# EasyEDA Pro project ProProject_扫描隧道显微镜OpenSTM_2023-08-25.epro, board ControlBoard
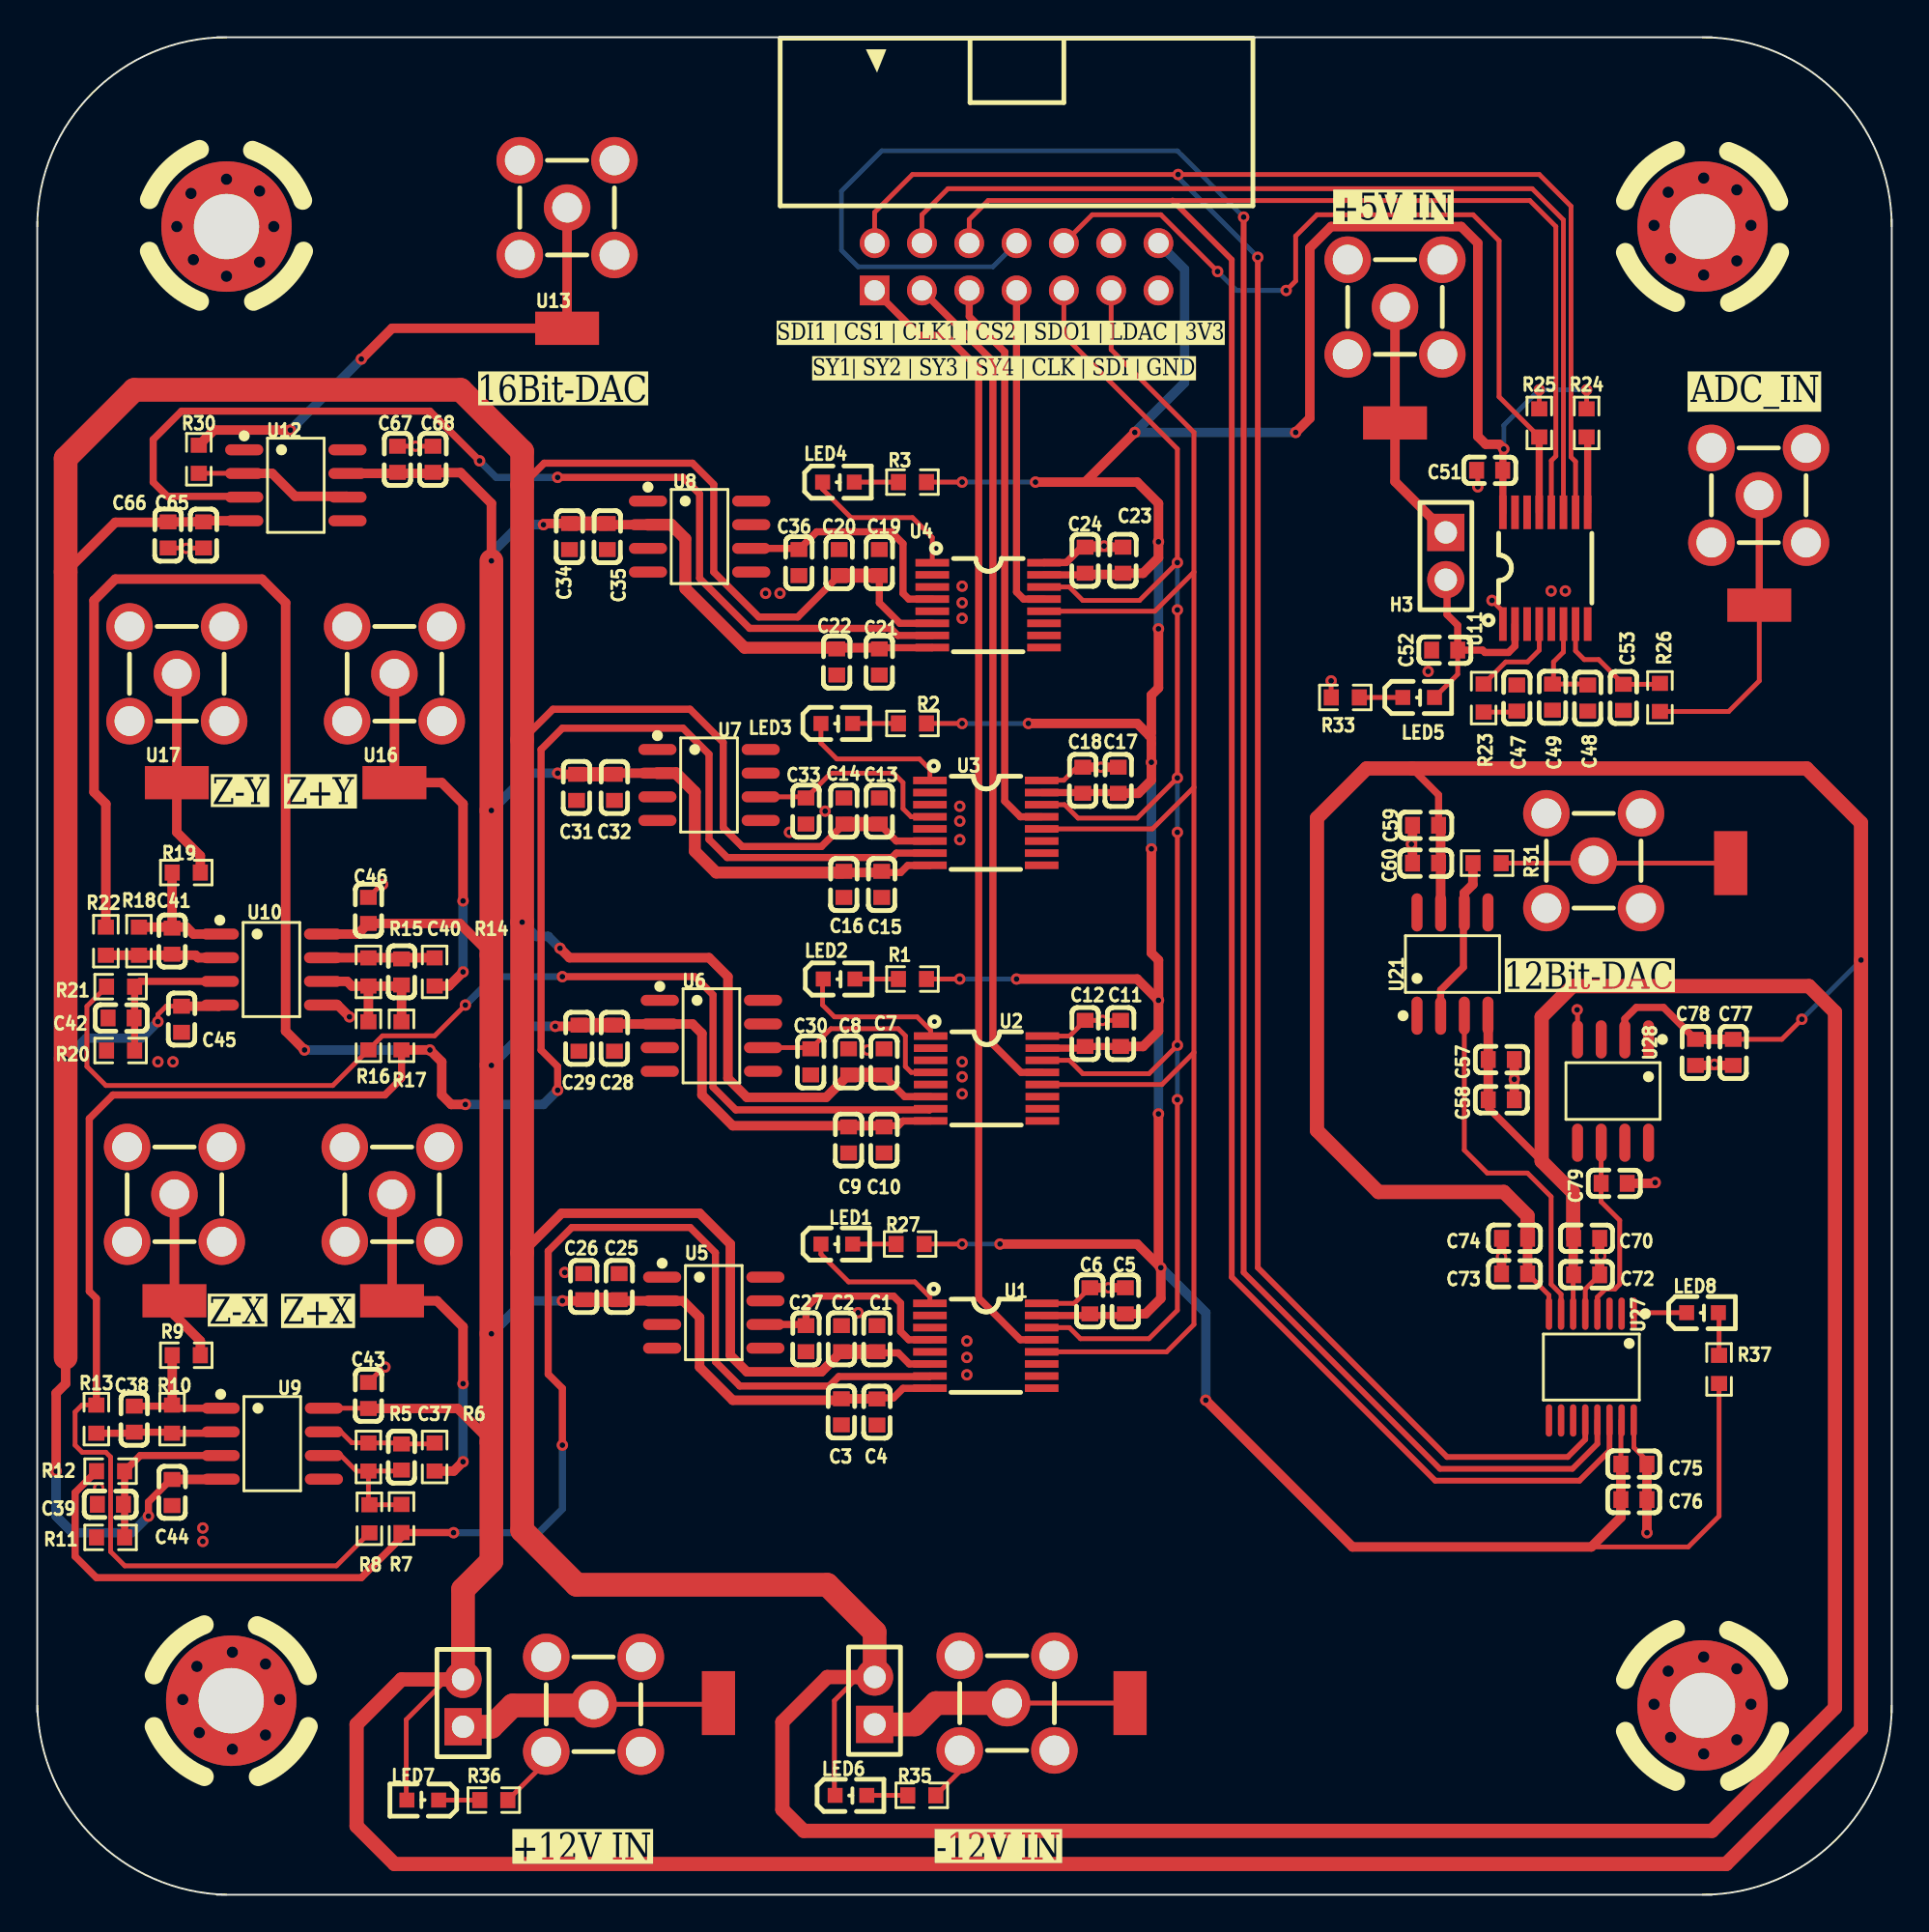
[diagram p14: board, top side]
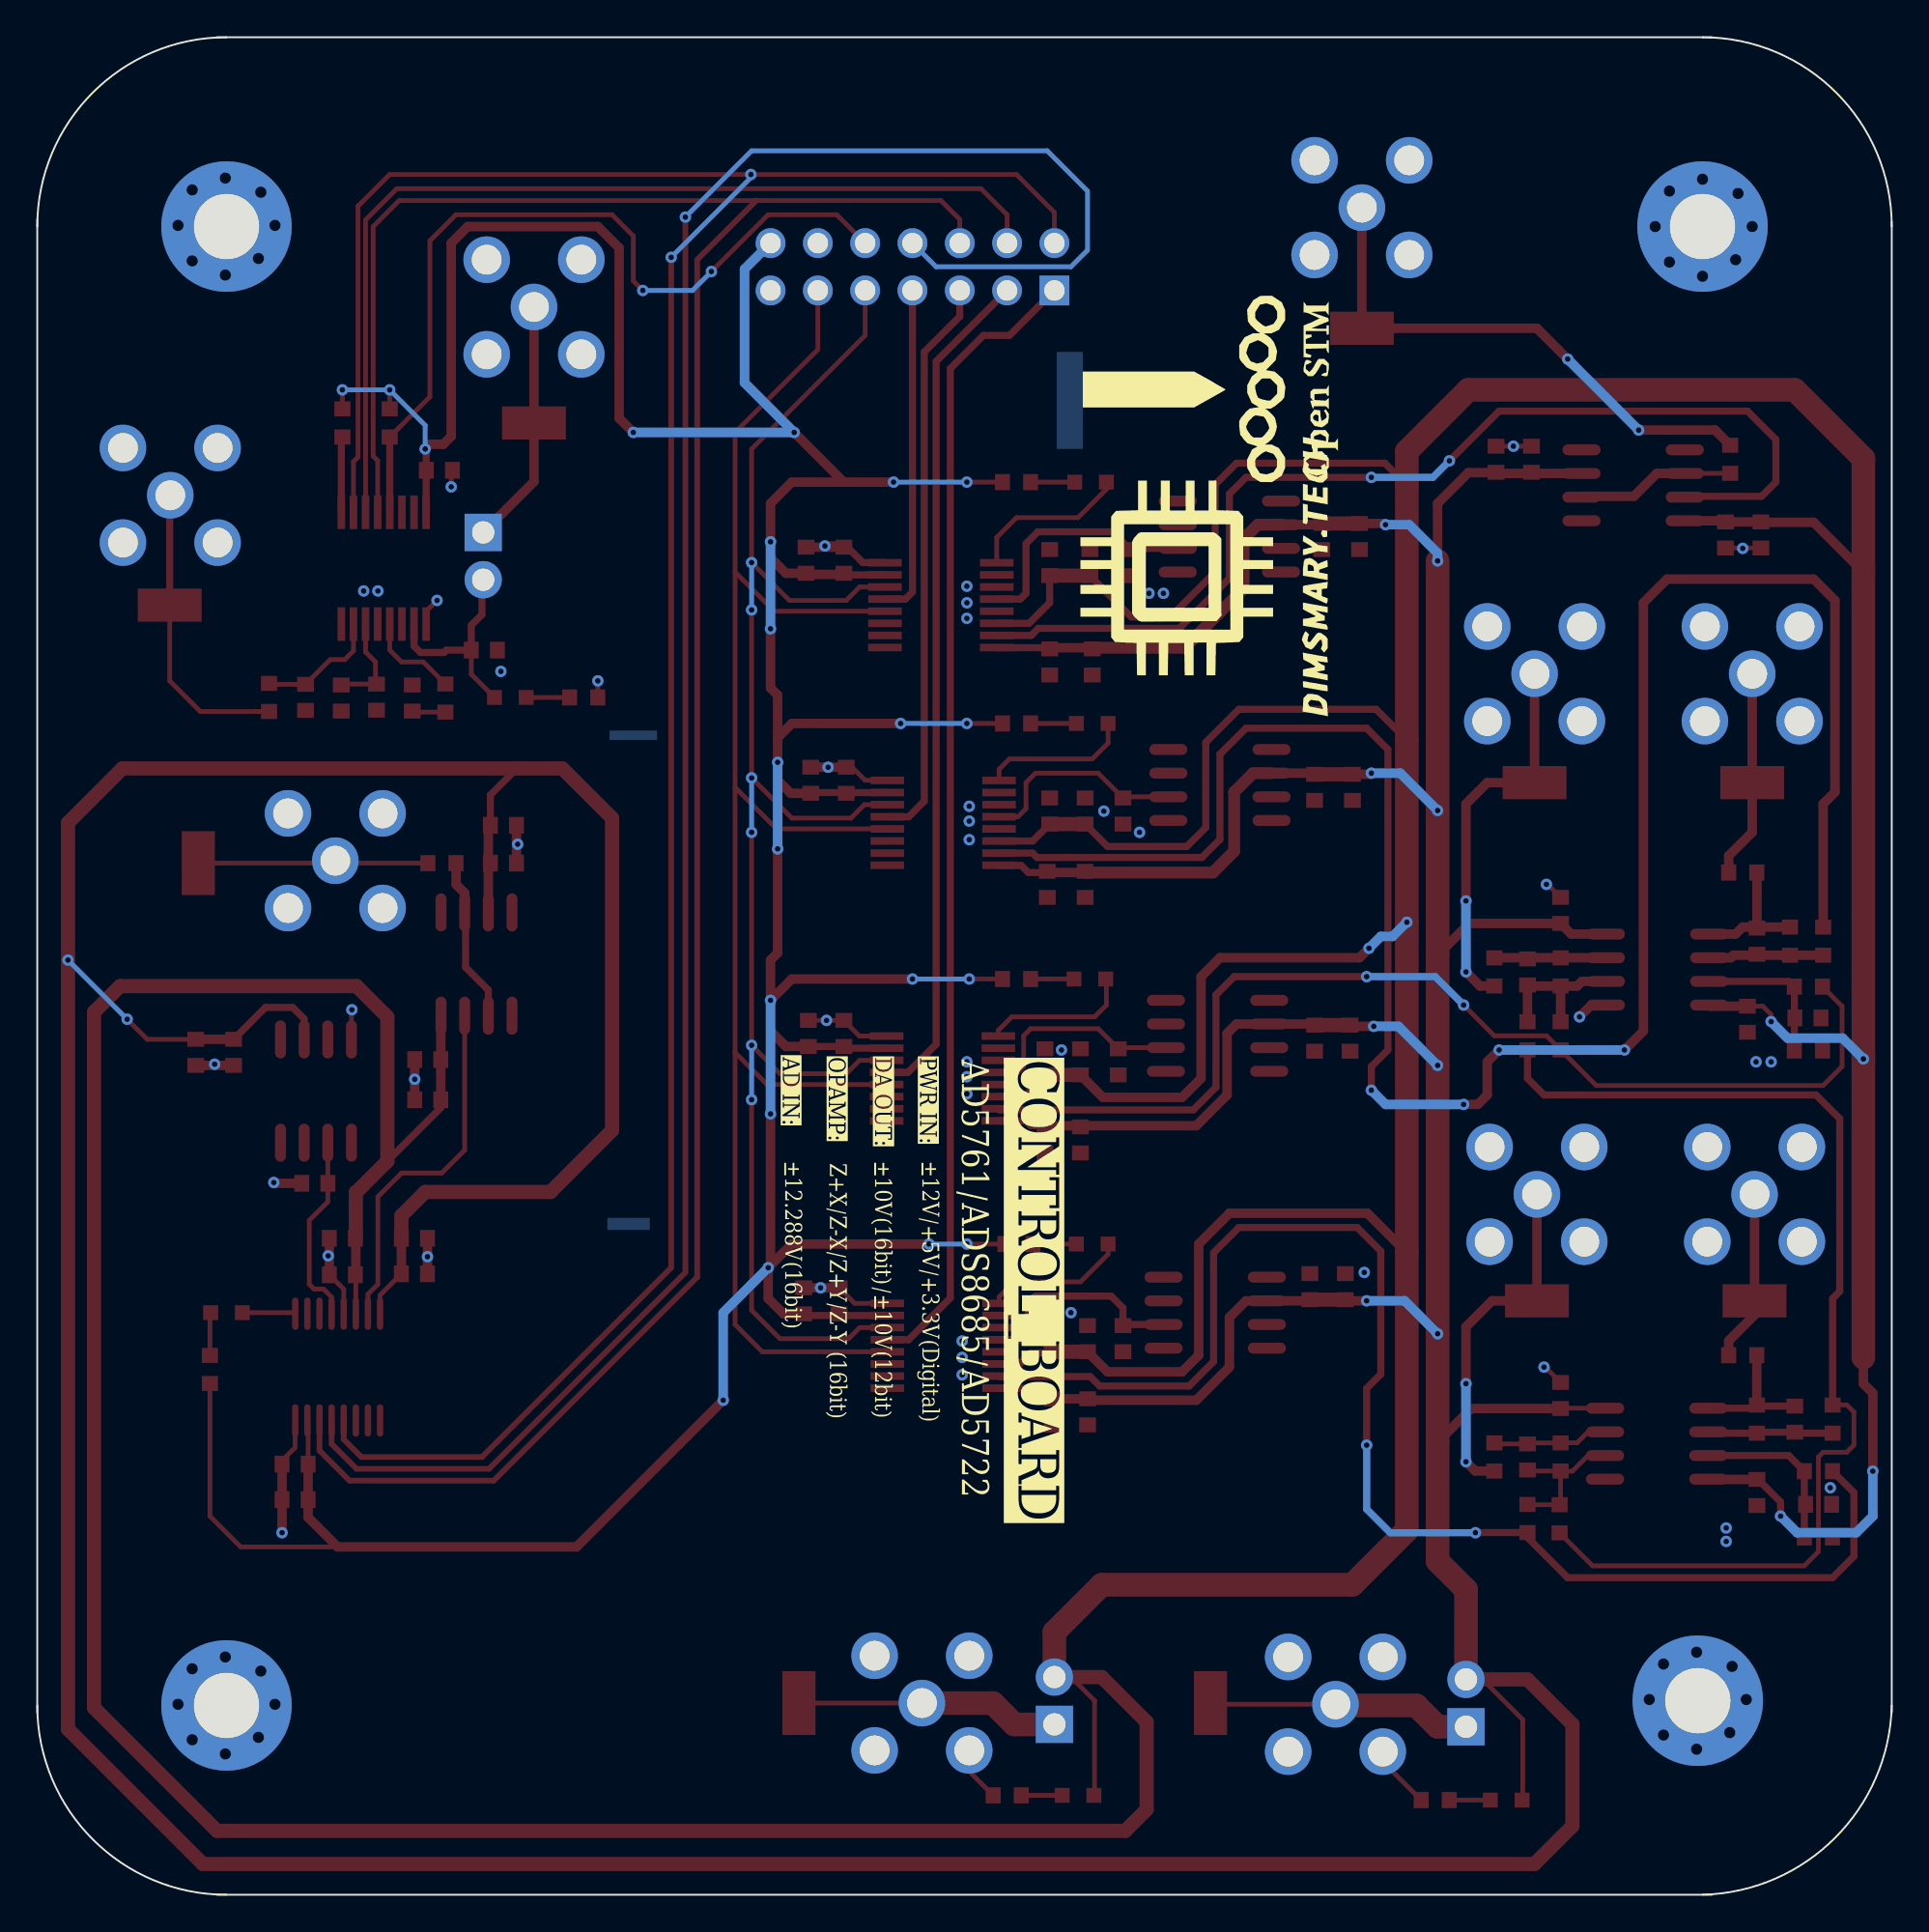
[diagram p15: board, bottom side, seen from below]

Outline 99.57 x 99.7 mm; copper layers: Top Layer, Bottom Layer. Coordinates in mm from the lower left corner of the outline.
Outline path: 0,89.54 arc(2.98,96.72) 10.16,99.7 ; 0,9.78 0,89.79 ; 9.65,99.7 89.92,99.7 ; 9.65,0 89.92,0 ; 10.16,0 arc(3.05,3.05) 0,10.16 ; 89.41,99.7 arc(96.59,96.72) 99.57,89.54 ; 99.57,10.16 arc(96.59,2.98) 89.41,0 ; 99.57,9.78 99.57,89.92
Stack: Top Layer 0.035mm / Dielectric1 1.51mm FR4 er 4.5 / Bottom Layer 0.035mm

## Design rules (mm)
spacing safeClearance (default): track to track 0.152, other pairs 0.152 to 0.3
track width trackWidth (default): min 0.127, default 0.254, max 2.54
differential pair differentialPair (default): width min 0.127, default 0.254, max 2.54; gap min 0.152, default 0.152
via viaSize (default): diameter min 0.5, default 0.61, max 10; hole min 0.3, default 0.305, max 6

## Placement (name value [footprint] x y rotation side)
C1  100nF  [C0603]  45.09 29.85 90 top
C2  10uF  [C0603]  43.18 29.85 90 top
C3  100nF  [C0603]  43.18 25.92 90 top
C4  10uF  [C0603]  45.09 25.91 90 top
C5  100nF  [C0603]  58.42 31.88 90 top
C6  10uF  [C0603]  56.51 31.88 90 top
C7  100nF  [C0603]  45.47 44.7 90 top
C8  10uF  [C0603]  43.56 44.7 90 top
C9  100nF  [C0603]  43.56 40.51 90 top
C10  10uF  [C0603]  45.47 40.51 90 top
C11  100nF  [C0603]  58.17 46.23 90 top
C12  10uF  [C0603]  56.26 46.23 90 top
C13  100nF  [C0603]  45.21 58.17 90 top
C14  10uF  [C0603]  43.31 58.17 90 top
C15  100nF  [C0603]  45.34 54.23 90 top
C16  10uF  [C0603]  43.31 54.23 90 top
C17  100nF  [C0603]  58.04 59.82 90 top
C18  10uF  [C0603]  56.13 59.82 90 top
C19  100nF  [C0603]  45.21 71.5 90 top
C20  10uF  [C0603]  43.05 71.5 90 top
C21  100nF  [C0603]  45.21 66.17 90 top
C22  10uF  [C0603]  42.93 66.17 90 top
C23  100nF  [C0603]  58.29 71.63 90 top
C24  10uF  [C0603]  56.26 71.63 90 top
C25  10uF  [C0603]  31.24 32.64 270 top
C26  100nF  [C0603]  29.34 32.64 270 top
C27  100nF  [C0603]  41.28 29.85 90 top
C28  10uF  [C0603]  30.99 45.97 90 top
C29  100nF  [C0603]  29.08 45.97 90 top
C30  100nF  [C0603]  41.53 44.7 90 top
C31  10uF  [C0603]  28.96 59.44 90 top
C32  100nF  [C0603]  30.99 59.44 90 top
C33  100nF  [C0603]  41.28 58.17 90 top
C34  10uF  [C0603]  28.57 72.9 90 top
C35  100nF  [C0603]  30.61 72.9 90 top
C36  100nF  [C0603]  40.89 71.5 90 top
C37  4.7nF  [C0603]  19.56 23.5 90 top
C38  4.7nF  [C0603]  5.21 25.53 90 top
C39  4.7nF  [C0603]  3.93 20.95 0 top
C40  4.7nF  [C0603]  19.56 49.53 270 top
C41  4.7nF  [C0603]  7.24 51.18 270 top
C42  4.7nF  [C0603]  4.5 47.06 180 top
C43  100nF  [C0603]  17.78 26.8 270 top
C44  100nF  [C0603]  7.24 21.59 270 top
C45  100nF  [C0603]  7.75 46.99 270 top
C46  100nF  [C0603]  17.78 52.83 270 top
C47  10uF  [C0603]  79.44 64.23 270 top
C48  22uF  [C0603]  83.25 64.23 90 top
C49  1uF  [C0603]  81.35 64.28 90 top
C51  1uF  [C0603]  77.98 76.45 180 top
C52  1uF  [C0603]  75.56 66.8 180 top
C53  330pF  [C0603]  85.16 64.27 90 top
C57  100nF  [C0603]  78.6 44.83 180 top
C58  10uF  [C0603]  78.6 42.67 180 top
C59  100nF  [C0603]  74.54 57.4 180 top
C60  10uF  [C0603]  74.54 55.37 180 top
C65  100nF  [C0603]  8.93 72.98 90 top
C66  10uF  [C0603]  7.02 72.98 90 top
C67  100nF  [C0603]  19.34 77.05 90 top
C68  10uF  [C0603]  21.25 77.05 90 top
C70  100nF  [C0603]  83.19 35.23 0 top
C72  10uF  [C0603]  83.19 33.27 0 top
C73  10uF  [C0603]  79.32 33.33 0 top
C74  100nF  [C0603]  79.32 35.23 0 top
C75  10uF  [C0603]  85.72 23.11 0 top
C76  100nF  [C0603]  85.72 21.21 0 top
C77  10uF  [C0603]  91.06 45.21 90 top
C78  100nF  [C0603]  89.03 45.21 90 top
C79  100nF  [C0603]  84.67 38.18 180 top
CN1  X9555WR-2x07-6TV01  [CONN-TH_14P-P2.54_XKB_X9555WR-2X7-6TV01]  52.58 87.38 180 top
H1  -  [HDR-TH_2P-P2.54-V-F]  22.86 10.29 90 top
H2  -  [HDR-TH_2P-P2.54-V-F]  44.96 10.41 90 top
H3  -  [HDR-TH_2P-P2.54-V-F]  75.63 71.85 270 top
LED1  -  [LED0603-R-RD]  42.93 34.93 0 top
LED2  -  [LED0603-R-RD]  43.05 49.15 0 top
LED3  -  [LED0603-R-RD]  42.93 62.87 0 top
LED4  -  [LED0603-R-RD]  43.01 75.82 0 top
LED5  -  [LED0603-R-RD]  74.17 64.26 0 top
LED6  -  [LED0603-R-RD]  43.69 5.33 0 top
LED7  -  [LED0603-R-RD]  20.7 5.08 180 top
LED8  -  [LED0603-R-RD]  89.41 31.24 0 top
NOREF  -  [Pad_e762]  10.41 10.41 0 top
NOREF#2  -  [Pad_e761]  10.16 89.54 0 top
NOREF#3  -  [Pad_e757]  89.41 89.54 0 top
NOREF#4  -  [Pad_e763]  89.41 10.16 0 top
R1  1kΩ  [R0603]  46.99 49.15 180 top
R2  1kΩ  [R0603]  46.99 62.87 180 top
R3  1kΩ  [R0603]  46.99 75.82 180 top
R5  3k  [R0603]  17.78 23.5 90 top
R6  220  [R0603]  21.34 23.5 270 top
R7  3k  [R0603]  19.56 20.19 90 top
R8  3k  [R0603]  17.83 20.18 90 top
R9  220  [R0603]  8 28.96 0 top
R10  3k  [R0603]  7.24 25.53 90 top
R11  3k  [R0603]  3.94 19.18 0 top
R12  3k  [R0603]  3.94 22.73 0 top
R13  3k  [R0603]  3.17 25.53 270 top
R14  220  [R0603]  21.34 49.53 90 top
R15  3k  [R0603]  17.78 49.53 270 top
R16  3k  [R0603]  17.78 46.1 270 top
R17  3k  [R0603]  19.56 46.1 270 top
R18  3k  [R0603]  5.46 51.18 270 top
R19  220  [R0603]  8 54.86 180 top
R20  3k  [R0603]  4.47 45.31 180 top
R21  3k  [R0603]  4.47 48.74 180 top
R22  3k  [R0603]  3.68 51.18 90 top
R23  0.47  [R0603]  77.66 64.23 90 top
R24  10k  [R0603]  83.19 78.99 90 top
R25  10k  [R0603]  80.65 78.99 90 top
R26  0.47  [R0603]  87.12 64.26 270 top
R27  1kΩ  [R0603]  46.86 34.93 180 top
R30  220  [R0603]  8.68 77.05 270 top
R31  220  [R0603]  77.84 55.37 180 top
R33  4.7kΩ  [R0603]  70.23 64.26 180 top
R35  10kΩ  [R0603]  47.49 5.33 0 top
R36  10kΩ  [R0603]  24.51 5.08 0 top
R37  1kΩ  [R0603]  90.3 28.19 90 top
RF1  -  [SMA-TH_KH-SMA-KE-Z]  28.45 90.55 0 top
RF2  -  [SMA-TH_KH-SMA-KE-Z]  19.05 37.59 0 top
RF3  -  [SMA-TH_KH-SMA-KE-Z]  7.37 37.59 0 top
RF4  -  [SMA-TH_KH-SMA-KE-Z]  19.18 65.53 0 top
RF5  -  [SMA-TH_KH-SMA-KE-Z]  7.49 65.53 0 top
RF6  -  [SMA-TH_KH-SMA-KE-Z]  92.43 75.11 0 top
RF7  -  [SMA-TH_KH-SMA-KE-Z]  29.87 10.22 0 top
RF8  -  [SMA-TH_KH-SMA-KE-Z]  52.07 10.29 0 top
RF9  -  [SMA-TH_KH-SMA-KE-Z]  72.9 85.22 90 top
RF10  -  [SMA-TH_KH-SMA-KE-Z]  83.57 55.5 270 top
U1  -  [TSSOP-16_L5.0-W4.4-P0.65-LS6.4-TL]  50.93 29.46 0 top
U2  -  [TSSOP-16_L5.0-W4.4-P0.65-LS6.4-TL]  50.96 43.81 0 top
U3  -  [TSSOP-16_L5.0-W4.4-P0.65-LS6.4-TL]  50.93 57.53 0 top
U4  -  [TSSOP-16_L5.0-W4.4-P0.65-LS6.4-TL]  51.05 69.22 0 top
U5  -  [SOIC-8_L4.9-W3.9-P1.27-LS6.0-BL]  36.32 31.24 270 top
U6  -  [SOIC-8_L4.9-W3.9-P1.27-LS6.0-BL]  36.19 46.1 270 top
U7  -  [SOIC-8_L4.9-W3.9-P1.27-LS6.0-BL]  36.07 59.56 270 top
U8  -  [SOIC-8_L4.9-W3.9-P1.27-LS6.0-BL]  35.56 72.9 270 top
U9  -  [SOIC-8_L4.9-W3.9-P1.27-LS6.0-BL]  12.62 24.21 270 top
U10  -  [SOIC-8_L4.9-W3.9-P1.27-LS6.0-BL]  12.57 49.66 270 top
U11  -  [TSSOP-16_L5.0-W4.4-P0.65-LS6.4-TL]  80.97 71.2 90 top
U12  -  [SOIC-8_L4.9-W3.9-P1.27-LS6.0-BL]  13.88 75.65 270 top
U13  -  [TEST-SMD_L2.7-W1.0]  28.45 84.07 0 top
U14  -  [TEST-SMD_L2.7-W1.0]  19.05 31.88 0 top
U15  -  [TEST-SMD_L2.7-W1.0]  7.37 31.88 0 top
U16  -  [TEST-SMD_L2.7-W1.0]  19.18 59.69 0 top
U17  -  [TEST-SMD_L2.7-W1.0]  7.49 59.69 0 top
U18  -  [TEST-SMD_L2.7-W1.0]  92.46 69.22 0 top
U19  -  [TEST-SMD_L2.7-W1.0]  36.58 10.29 90 top
U21  AD8671ARZ-REEL7  [SOIC-8_L4.9-W3.9-P1.27-LS6.0-BL]  75.98 49.95 0 top
U22  -  [TEST-SMD_L2.7-W1.0]  90.92 55.37 270 top
U25  -  [TEST-SMD_L2.7-W1.0]  58.67 10.29 90 top
U26  -  [TEST-SMD_L2.7-W1.0]  72.9 78.99 0 top
U27  AD5721RBRUZ-RL7  [TSSOP-16_L5.0-W4.4-P0.65-LS6.4-BL]  83.44 28.32 180 top
U28  -  [SOIC-8_L4.9-W3.9-P1.27-LS6.0-BL]  84.6 43.14 180 top

## Footprints (pads in the part's own frame, mm; a bottom-side part is the same pattern mirrored in y, then rotated)
C0603
  rect 0.8x0.9 smd: 1(-0.7,0) 2(0.7,0)
CONN-TH_14P-P2.54_XKB_X9555WR-2X7-6TV01
  rect 1.6x1.6 hole 1.1: 1(7.62,1.27)
  round 1.6 hole 1.1: 2(7.62,-1.27) 3(5.08,1.27) 4(5.08,-1.27) 5(2.54,1.27) 6(2.54,-1.27) 7(0,1.27) 8(0,-1.27) 9(-2.54,1.27) 10(-2.54,-1.27) 11(-5.08,1.27) 12(-5.08,-1.27) 13(-7.62,1.27) 14(-7.62,-1.27)
HDR-TH_2P-P2.54-V-F
  rect 1.999x1.999 hole 1.199: 1(-1.27,0)
  round 1.999 hole 1.199: 2(1.27,0)
LED0603-R-RD
  rect 0.8x0.8 smd: 1(0.851,0) 2(-0.851,0)
Pad_e757
  round 7 hole 3.5: 1(0,0)
Pad_e761
  round 7 hole 3.5: 1(0,0)
Pad_e762
  round 7 hole 3.5: 1(0,0)
Pad_e763
  round 7 hole 3.5: 1(0,0)
R0603
  rect 0.806x0.864 smd: 1(-0.753,0) 2(0.753,0)
SMA-TH_KH-SMA-KE-Z
  round 2.499 hole 1.6: 1(-2.54,-2.54) 2(-2.54,2.54) 3(2.54,2.54) 4(2.54,-2.54) 5(0,0)
SOIC-8_L4.9-W3.9-P1.27-LS6.0-BL
  oval 0.59x2.045 smd: 1(-1.905,-2.771) 2(-0.635,-2.771) 3(0.635,-2.771) 4(1.905,-2.771) 5(1.905,2.773) 6(0.635,2.773) 7(-0.635,2.773) 8(-1.905,2.773)
TEST-SMD_L2.7-W1.0
  rect 3.429x1.78 smd: 1(0,0)
TSSOP-16_L5.0-W4.4-P0.65-LS6.4-BL
  oval 0.343x1.732 smd: 1(-2.275,-2.866) 2(-1.625,-2.866) 3(-0.975,-2.866) 4(-0.325,-2.866) 5(0.325,-2.866) 6(0.975,-2.866) 7(1.625,-2.866) 8(2.275,-2.866) 9(2.275,2.866) 10(1.625,2.866) 11(0.975,2.866) 12(0.325,2.866) 13(-0.325,2.866) 14(-0.975,2.866) 15(-1.625,2.866) 16(-2.275,2.866)
TSSOP-16_L5.0-W4.4-P0.65-LS6.4-TL
  rect 1.804x0.406 smd: 1(-2.999,2.276) 2(-2.999,1.625) 3(-2.999,0.976) 4(-2.999,0.325) 5(-2.999,-0.325) 6(-2.999,-0.976) 7(-2.999,-1.625) 8(-2.999,-2.276) 9(2.999,-2.276) 10(2.999,-1.625) 11(2.999,-0.976) 12(2.999,-0.325) 13(2.999,0.325) 14(2.999,0.976) 15(2.999,1.625) 16(2.999,2.276)

## Nets
As in the schematic, except:
AGND: C1.2 C2.2 C3.1 C4.1 C5.2 C6.2 C7.2 C8.2 C9.1 C10.1 C11.2 C12.2 C13.2 C14.2 C15.1 C16.1 C17.2 C18.2 C19.2 C20.2 C21.1 C22.1 C23.2 C24.2 C25.1 C26.1 C27.1 C28.1 C29.1 C30.1 C31.1 C32.1 C33.1 C34.1 C35.1 C36.1 C39.1 C42.2 C43.1 C44.2 C45.2 C46.1 C47.1 C48.1 C49.1 C51.2 C52.2 C53.1 C57.1 C58.1 C59.2 C60.2 C65.1 C66.1 C67.2 C68.2 C70.2 C72.2 C73.1 C74.1 C75.2 C76.2 C77.1 C78.1 C79.1 CN1.13 NOREF.1 NOREF#2.1 NOREF#3.1 NOREF#4.1 R11.1 R20.2 R33.2 R35.2 R36.2 RF1.1 RF1.2 RF1.3 RF1.4 RF2.1 RF2.2 RF2.3 RF2.4 RF3.1 RF3.2 RF3.3 RF3.4 RF4.1 RF4.2 RF4.3 RF4.4 RF5.1 RF5.2 RF5.3 RF5.4 RF6.1 RF6.2 RF6.3 RF6.4 RF7.1 RF7.2 RF7.3 RF7.4 RF8.1 RF8.2 RF8.3 RF8.4 RF9.1 RF9.2 RF9.3 RF9.4 RF10.1 RF10.2 RF10.3 RF10.4 U1.5 U1.16 U2.5 U2.16 U3.5 U3.16 U4.5 U4.16 U5.4 U6.4 U7.4 U8.4 U9.5 U10.5 U11.1 U11.3 U11.5 U11.8 U27.5 U27.16 U28.4

Pads without a net: CN1 12; U1 2 3 9 10 11; U2 2 3 9 10 11; U3 2 3 9 10 11; U4 2 3 9 10 11; U5 1 3 5 7 8; U6 1 3 5 7 8; U7 1 3 5 7 8; U8 1 3 5 7 8; U11 14 15; U12 1 5 8; U21 1 5 8; U27 2 3 9 10 11; U28 1 3 5 7 8

## Via types
v1: diameter 1.219, hole 0.61, Top Layer to Bottom Layer, 32 vias
v2: diameter 0.61, hole 0.305, Top Layer to Bottom Layer, 111 vias

## Routing (per net, layer and track width the routed paths; a pad name or vN(x,y) marks a point on that pad's centre or on a via; arc(x,y) is an arc through that point)
3V3: length 246.6
  Top Layer w0.254: v2(49.66,75.82) R3.1 ; R27.1 v2(49.66,34.93) ; R37.1 90.3,20.32 88.65,18.67 83.44,18.67 ; v2(83.19,80.77) R24.2 ; 85.03,25.46 C75.1 ; R2.1 v2(49.66,62.87) ; 59.69,61.92 59.82,61.79 ; v2(80.65,80.77) R25.2 ; R1.1 v2(49.53,49.15)
  Top Layer w0.381: U3.15 58,59.16 ; v2(78.74,77.6) 78.69,77.55 U11.16 ; U2.15 56.17,45.44 C12.1 C11.1 ; C5.1 58.33,31.09 U1.15 ; C24.1 56.17,70.84 U4.15
  Top Layer w0.508: 59.69,62.23 59.06,62.87 v2(53.21,62.87) ; 59.69,62.23 59.82,62.1 v2(59.82,60.78) 59.82,59.82 59.12,59.12 C17.1 58,59.16 ; 59.69,62.23 59.82,62.36 59.82,64.39 60.2,64.77 v2(60.2,67.95) ; C11.1 59.37,45.53 60.2,46.36 v2(60.2,48.01) ; v2(59.82,56.13) 59.82,50.55 60.2,50.17 v2(60.2,48.01) ; v2(58.93,78.49) 56.26,75.82 ; 56.26,75.82 v2(53.59,75.82) ; 56.26,75.82 59.06,75.82 60.2,74.68 v2(60.2,72.62) 60.2,71.76 59.37,70.93 C23.1 58.23,70.87 56.32,70.87 C24.1 ; v2(60.2,48.01) 59.06,49.15 v2(52.58,49.15) ; 60.2,33.78 v2(60.32,33.66) 60.32,32 59.5,31.18 C5.1 ; 60.2,33.78 v2(60.2,41.91) ; 60.2,33.78 59.06,34.93 v2(51.69,34.93) ; v2(62.74,26.54) 70.61,18.67 83.44,18.67 85.03,20.26 C76.1 C75.1 ; v2(78.74,77.6) 78.49,77.85 77.77,77.85 77.34,78.28 77.34,88.65 76.45,89.54 69.47,89.54 68.33,88.39 68.33,79.25 v2(67.56,78.49)
  Bottom Layer w0.254: v2(49.66,62.87) v2(53.21,62.87) ; v2(49.66,34.93) v2(51.69,34.93) ; v2(78.74,77.6) 78.74,78.87 v2(80.65,80.77) v2(83.19,80.77) ; v2(53.59,75.82) v2(49.66,75.82) ; v2(49.53,49.15) v2(52.58,49.15)
  Bottom Layer w0.508: v2(60.32,33.66) 62.74,31.24 v2(62.74,26.54) ; v2(60.2,48.01) v2(60.2,41.91) ; v2(67.56,78.49) v2(58.93,78.49) 61.59,81.15 61.59,87.25 CN1.14 ; v2(59.82,60.78) v2(59.82,56.13) ; v2(60.2,72.62) v2(60.2,67.95)
+5V: length 11.5
  Top Layer w0.254: C52.1 76.26,65.51 LED5.1
  Top Layer w0.381: U11.2 79.34,67.02 78.99,66.68 77.72,66.68 77.6,66.8 C52.1 76.26,68.13 75.69,68.71 75.69,70.51 H3.2
+12V: length 451
  Top Layer w0.254: C77.2 93.66,45.91 v2(94.74,46.99) ; U27.8 81.16,32.18 C73.2 ; LED7.1 19.81,5.12 19.81,9.4 21.97,11.56 ; 15.39,26.11 17.76,26.11
  Top Layer w0.381: 45.47,41.28 46.23,41.28 46.48,41.53 47.96,41.53 U2.8 ; C4.2 45.15,26.67 45.97,26.67 46.48,27.18 47.92,27.18 U1.8 ; C59.1 75.24,59.03 73.81,60.45 ; U28.2 85.24,47.01 85.85,47.63 87.31,47.63 C78.2 ; C15.2 45.4,54.86 46.35,54.86 46.74,55.25 47.92,55.25 U3.8 ; 45.64,66.93 48.04,66.93 U4.8
  Top Layer w0.508: 45.47,41.28 37.34,41.28 35.69,42.93 35.69,46.23 35.18,46.74 U6.2 31.05,46.74 30.99,46.67 ; v2(24.38,71.59) 24.38,74.68 22.73,76.33 21.27,76.33 ; C35.2 30.67,73.53 U8.2 ; C16.2 43.37,54.86 45.15,54.86 ; 29.08,46.67 29.02,46.61 v2(27.81,46.61) ; C4.2 45.07,26.62 C3.2 43.1,26.54 37.34,26.54 35.56,28.32 35.56,30.99 34.67,31.88 U5.2 31.3,31.88 C25.2 ; C26.2 29.28,31.88 v2(28.19,31.88) ; C59.1 75.35,57.29 U21.7 ; 43.31,66.93 45.34,66.93 ; v2(27.18,73.53) 27.24,73.6 C34.2 ; 33.3,60.2 31.05,60.2 C32.2 ; 21.27,76.33 21.22,76.28 U12.7 ; 21.27,76.33 C68.1 ; C73.2 C74.2 ; C43.2 22.57,26.1 24.38,24.29 ; U10.8 17.21,51.56 C46.2 22.68,52.13 24.38,50.43 ; v2(27.94,60.2) 28,60.14 C31.2 ; C77.2 C78.2
  Top Layer w0.635: 33.3,60.2 34.29,60.2 35.31,59.18 35.31,56.01 36.45,54.86 43.24,54.86 ; 43.18,66.93 37.97,66.93 34.8,70.1 34.8,72.77 34.04,73.53 U8.2
  Top Layer w0.762: 80.01,36.45 78.74,37.72 72.01,37.72 68.71,41.02 68.71,57.79 71.37,60.45 95,60.45 97.92,57.53 v2(97.92,50.17) 97.92,8.89 90.68,1.65 19.18,1.65 17.14,3.68 17.14,9.14 19.56,11.56 H1.2 ; C34.2 30.54,73.6 ; 29.08,46.67 30.99,46.67 ; 80.02,36.45 C74.2 ; C31.2 C32.2 ; C26.2 C25.2
  Top Layer w1.27: H1.2 22.86,16.38 24.38,17.91 v2(24.38,30.11) v2(24.38,44.51) v2(24.38,58.19) v2(24.38,71.59)
  Bottom Layer w0.254: v2(94.74,46.99) v2(97.92,50.17)
  Bottom Layer w0.508: v2(24.38,71.59) 24.38,72.01 25.91,73.53 v2(27.18,73.53) ; v2(24.38,30.11) 26.15,31.88 v2(28.19,31.88) ; v2(24.38,58.19) 26.39,60.2 v2(27.94,60.2) ; v2(24.38,44.51) 26.48,46.61 v2(27.81,46.61)
-12V: length 476
  Top Layer w0.254: 44.07,11.68 42.8,10.41 42.8,5.37 LED6.2 ; v2(6.48,46.86) 6.48,47.24 6.92,47.69 C45.1 ; U27.6 82.46,33.27
  Top Layer w0.381: C58.2 77.9,42.24 80.77,39.37 ; C14.1 42.1,56.26 37.85,56.26 36.83,57.28 36.83,61.85 35.05,63.63 27.69,63.63 26.03,61.98 ; U3.6 46.12,56.56 C13.1 ; C1.1 45.15,29.08 46.23,29.08 46.82,28.49 U1.6 ; U4.6 46.31,68.24 45.21,69.34 C19.1 ; 7.18,22.29 5.97,21.08 v2(5.97,20.32) ; C20.1 40.83,68.58 38.74,68.58 36.32,70.99 36.32,75.69 35.18,76.84 27.22,76.84 26.03,75.65 ; 45.47,44 45.47,43.94 46.57,42.84 U2.6
  Top Layer w0.508: 82.46,35.23 82.46,33.3 C72.1 ; C45.1 9.74,47.69 U10.4 ; C2.1 42.1,28.07 38.1,28.07 37.21,28.96 37.21,34.93 35.56,36.58 28.15,36.58 26.03,34.46 ; 1.52,28.83 1.52,27.43 1.02,26.92 v2(1.02,22.73) ; U21.4 77.9,47.17 C57.2 C58.2 ; U9.4 9.83,22.29 C44.1 ; 6.64,73.68 7.04,73.68 ; 7.04,73.68 7.02,73.66 4.19,73.66 1.52,70.99 ; 7.04,73.68 8.55,73.68 8.61,73.74 U12.4 ; v2(28.07,50.8) 28.57,50.29 36.07,50.29 37.08,49.28 37.08,43.82 38.1,42.8 42.36,42.8 43.56,44
  Top Layer w0.762: C13.1 C14.1 ; 45.47,44 43.56,44 ; 82.46,37.72 82.46,35.23 ; C19.1 C20.1 ; H2.2 42.42,11.68 40,9.27 40,4.57 41.15,3.43 89.92,3.43 96.52,10.03 96.52,47.37 95.12,48.77 82.42,48.77 80.77,47.12 80.77,39.37 82.42,37.72 ; C2.1 C1.1
  Top Layer w1.27: 1.52,28.83 v2(1.52,44.86) 1.52,77.09 5.21,80.77 22.73,80.77 26.03,77.47 v2(26.03,52.2) 26.03,19.56 28.96,16.64 42.42,16.64 44.96,14.1 H2.2
  Bottom Layer w0.508: v2(6.48,46.86) 5.59,45.97 2.64,45.97 v2(1.52,44.86) ; v2(28.07,50.8) 27.43,51.44 26.8,51.44 v2(26.03,52.2) ; v2(5.97,20.32) 5.08,19.43 1.91,19.43 1.02,20.32 v2(1.02,22.73)
AGND: length 58.8
  Top Layer w0.254: U3.16 53.94,59.82 55.12,59.82 55.82,60.52 C18.2 ; U28.4 82.7,47.48 v2(82.68,47.5) ; U2.16 55.42,46.09 C12.2 v2(57.19,46.93) C11.2 ; C66.1 C65.1 ; C72.2 83.11,32.5 U27.5 ; v2(18.67,28.32) 18.6,28.32 C43.1 ; U11.1 78.69,68.88 v2(78.1,69.47) ; U1.16 55.68,31.74 C6.2 ; R33.2 69.47,64.27 v2(69.47,65.15) ; R36.2 27.33,7.14 RF7.1 ; 85.72,25.46 85.72,24 86.43,23.3 C75.2 ; C68.2 v2(20.31,77.75) C67.2 ; v2(77.34,75.57) 77.34,76.39 C51.2 ; v2(18.54,54.23) 18.48,54.23 C46.1 ; R35.2 49.53,6.62 RF8.1
  Top Layer w0.381: U4.16 54.06,71.5 55.25,71.5 56.07,72.33 C24.2
  Top Layer w0.508: C18.2 v2(57.11,60.52) C17.2 ; C58.1 v2(79.3,43.77) C57.1 ; v2(86.43,19.43) C76.2 C75.2 ; v2(86.87,38.23) 86.82,38.18 C79.1 ; C73.1 v2(78.62,34.25) C74.1 ; C23.2 C24.2 56.32,72.39 v2(57.28,72.39) ; C78.1 C77.1 ; v2(16.76,47.12) 16.13,47.75 U10.5 ; C5.2 v2(57.51,32.58) C6.2 ; C72.2 83.88,35.23 ; C60.2 C59.2
  vias: v1(7.49,89.54) v1(7.81,10.48) v1(8.25,91.31) v1(8.38,87.76) v1(8.57,12.26) v1(8.7,8.7) v1(10.16,92.08) v1(10.16,86.87) v1(10.48,13.02) v1(10.48,7.81) v1(11.94,91.44) v1(11.94,87.63) v1(12.26,12.38) v1(12.26,8.57) v1(12.7,89.54) v1(13.02,10.48) v1(86.8,89.6) v1(86.8,10.22) v1(87.57,91.38) v1(87.57,12) v1(87.69,87.82) v1(87.69,8.45) v1(89.47,92.14) v1(89.47,86.93) v1(89.47,12.76) v1(89.47,7.56) v1(91.25,91.5) v1(91.25,87.69) v1(91.25,12.13) v1(91.25,8.32) v1(92.01,89.6) v1(92.01,10.22) v2(3.3,21.84) v2(6.48,44.7) v2(7.29,44.7) v2(8,72.26) v2(8.89,19.69) v2(8.89,18.96) v2(28.32,33.4) v2(39.1,69.85) v2(39.88,69.85) v2(40.39,57.02) v2(42.3,58.16) v2(44.07,31.24) v2(44.58,45.34) v2(49.53,58.42) v2(49.53,57.62) v2(49.53,56.63) v2(49.66,70.23) v2(49.66,69.34) v2(49.66,68.51) v2(49.66,44.7) v2(49.66,43.9) v2(49.66,42.99) v2(49.91,29.72) v2(49.91,28.84) v2(49.91,27.91) v2(73.78,56.38) v2(74.68,65.66) v2(81.28,69.98) v2(82.04,69.98) v2(83.95,34.29) v2(90.04,44.58)
ADCIN: length 16
  Top Layer w0.254: R26.2 90.81,63.51 92.46,65.15 U18.1
  Top Layer w0.381: U18.1 92.46,75.08 RF6.5
BIAS_OUT: length 19.4
  Top Layer w0.254: U27.7 81.81,32.23 81.28,32.76 81.28,37.47 80.01,38.74 77.85,38.74 76.62,39.97 U21.3
CS1: length 52.9
  Top Layer w0.254: U11.11 81.94,89.89 80.26,91.57 48.9,91.57 47.5,90.17 CN1.4
CS2: length 119.2
  Top Layer w0.305: U27.13 83.76,24.2 82.42,22.86 75.31,22.86 64.77,33.4 v2(64.77,90.04)
  Bottom Layer w0.254: v2(64.77,90.04) 61.21,93.6 45.34,93.6 43.18,91.44 43.18,88.27 44.07,87.38 51.31,87.38 CN1.8
PZT_SLIDE: length 57.6
  Top Layer w0.381: v2(27.94,76.07) 34.67,76.07 35.56,75.18 35.56,70.66 38.25,67.97 45.82,67.97 46.2,67.59 U4.7 ; v2(23.75,76.96) 21.08,79.63 7.75,79.63 6.22,78.11 6.22,75.82 6.98,75.06 11.07,75.06 U12.3
  Bottom Layer w0.381: v2(23.75,76.96) 24.64,76.07 v2(27.94,76.07)
PZT_SLIDE_OUT: length 8.5
  Top Layer w0.254: R30.2 11.1,76.29 U12.2
  Top Layer w0.508: U12.6 16.61,75.06 13.84,75.06 12.62,76.28 U12.2
SCLK: length 90.4
  Top Layer w0.254: U4.14 55.41,70.19 56.13,69.47 59.18,69.47 v2(61.21,71.5) 61.21,77.6 55.12,83.69 CN1.9 ; U3.14 55.16,58.51 55.88,57.79 59.06,57.79 v2(61.21,59.94) v2(61.21,68.96) ; v2(61.21,42.67) 61.21,31.37 59.69,29.85 56.01,29.85 55.41,30.44 U1.14 ; U2.14 55.42,44.79 56.13,44.07 59.69,44.07 v2(61.21,45.59) v2(61.21,57.02)
  Bottom Layer w0.254: v2(61.21,71.5) v2(61.21,68.96) ; v2(61.21,42.67) v2(61.21,45.59) ; v2(61.21,57.02) v2(61.21,59.94)
SCLK1: length 135.4
  Top Layer w0.254: CN1.6 50.04,89.92 51.05,90.93 80.14,90.93 81.53,89.54 81.53,77.22 81.29,76.97 U11.12
  Top Layer w0.305: 60.96,90.93 64.13,87.76 64.13,33.15 75.06,22.23 82.8,22.23 84.41,23.84 U27.14
SDI: length 93
  Top Layer w0.254: 62.1,59.44 59.87,57.21 U3.12 ; 62.1,59.44 62.1,70.99 ; 62.1,59.44 62.1,45.21 ; 62.1,45.21 60.38,43.49 U2.12 ; 62.1,45.21 62.1,30.61 60.63,29.14 U1.12 ; 62.1,70.99 62.1,78.49 57.66,82.93 CN1.11 ; 62.1,70.99 60,68.89 U4.12
SDI1: length 140.8
  Top Layer w0.254: U11.10 82.59,76.92 82.35,77.16 82.35,90.63 80.65,92.33 v2(61.25,92.33) 46.99,92.33 44.96,90.3 CN1.2
  Top Layer w0.305: U27.12 83.11,24.44 82.17,23.5 75.69,23.5 65.53,33.66 v2(65.53,87.88)
  Bottom Layer w0.254: v2(65.53,87.88) 61.21,92.2 61.21,92.33
SDO1: length 44.8
  Top Layer w0.254: R25.1 78.49,80.4 78.49,88.77 77.09,90.17 68.71,90.17 67.56,89.03 67.56,86.61 v2(67.06,86.11) ; v2(63.37,87.12) 60.32,90.17 56.64,90.17 CN1.10
  Top Layer w0.381: R25.1 80.64,78.24 U11.13
  Bottom Layer w0.254: v2(67.06,86.11) 64.39,86.11 v2(63.37,87.12)
SYNC1: length 61.5
  Top Layer w0.381: CN1.1 47.37,83.69 48.77,83.69 50.55,81.92 50.55,32.03 52.78,29.79 U1.13
SYNC2: length 45.3
  Top Layer w0.381: CN1.3 51.31,82.3 51.31,45.65 52.82,44.14 U2.13
SYNC3: length 30.5
  Top Layer w0.381: U3.13 52.78,57.86 51.94,58.7 51.94,82.8 50.04,84.71 CN1.5
SYNC4: length 17.8
  Top Layer w0.381: CN1.7 52.58,69.92 52.96,69.54 U4.13
VOLTAGE_OUT: length 8.9
  Top Layer w0.381: U21.6 76.57,52.68 76.57,49.78 75.35,48.56 U21.2
  Top Layer w0.508: U21.6 76.62,53.76 77.08,54.22 77.08,55.36 77.09,55.37
VREF1: length 11.9
  Top Layer w0.381: U5.6 41.21,30.61 C27.2 41.28,31.5 41.91,32.13 45.97,32.13 46.35,31.75 46.35,30.23 46.79,29.79 U1.4
VREF2: length 11.4
  Top Layer w0.254: U6.6 41.47,45.47 C30.2 42.61,46.48 46.23,46.48 46.61,46.1 46.61,44.45 46.92,44.14 U2.4
VREF3: length 11.5
  Top Layer w0.254: U7.6 41.21,58.93 C33.2 42.61,60.2 45.97,60.2 46.48,59.69 46.48,58.29 46.92,57.86 U3.4
VREF4: length 13.2
  Top Layer w0.381: U8.6 40.83,72.26 C36.2 41.84,73.15 45.85,73.15 46.48,72.52 46.48,69.85 46.79,69.54 U4.4
VREF5: length 10.4
  Top Layer w0.254: U27.4 83.76,32.08 84.2,32.51 84.71,32.51 84.96,32.77 84.96,36.2 83.97,37.19 C79.2 83.97,40.36
XOUT: length 75.7
  Top Layer w0.381: v2(28.19,24.13) 28.19,27.18 27.43,27.94 27.43,34.54 28.7,35.81 35.05,35.81 36.41,34.46 36.41,28.61 37.72,27.31 42.53,27.31 43.03,27.81 47.9,27.81 U1.7 ; R12.1 2.03,21.58 2.03,18.16 3.17,17.02 17.4,17.02 19.56,19.18 R7.1 22.34,19.44 v2(22.35,19.43)
  Bottom Layer w0.381: v2(28.19,24.13) 28.19,20.7 26.92,19.43 v2(22.35,19.43)
YOUT: length 58.8
  Top Layer w0.254: v2(22.99,47.75) 21.34,46.1 18.53,46.1 R16.2 15.87,43.43 3.68,43.43 2.67,44.45 2.67,47.69 R21.2
  Top Layer w0.381: v2(28.19,49.28) 35.31,49.28 36.28,48.3 36.28,43.35 37.5,42.13 47.91,42.13 U2.7
  Bottom Layer w0.381: v2(28.19,49.28) 24.51,49.28 v2(22.99,47.75)
Z+X: length 19.1
  Top Layer w0.508: RF2.5 U14.1 21.46,31.88 22.86,30.48 v2(22.86,27.43) ; v2(22.86,23.24) 22.36,22.74 R6.2
  Bottom Layer w0.508: v2(22.86,23.24) v2(22.86,27.43)
Z+Y: length 20.9
  Top Layer w0.508: RF4.5 U16.1 21.72,59.69 22.86,58.55 v2(22.86,53.34) ; v2(22.86,49.53) 22.11,48.78 R14.1
  Bottom Layer w0.508: v2(22.86,49.53) v2(22.86,53.34)
Z-X: length 9.2
  Top Layer w0.508: R9.2 8.76,29.73 7.37,31.12 U15.1 RF3.5
Z-Y: length 11.2
  Top Layer w0.508: RF5.5 U17.1 7.49,57.02 8.76,55.76 R19.1
ZOUT: length 176.8
  Top Layer w0.254: R8.1 16.06,17.65 4.7,17.65 3.94,18.42 3.94,23.5 3.68,23.75 2.41,23.75 2.03,24.13 2.03,25.91 2.41,26.29 3.17,26.29 R13.1
  Top Layer w0.381: R17.2 19.56,43.82 18.67,42.93 4.06,42.93 2.79,41.66 2.79,32.39 3.17,32 R13.1 ; v2(27.94,43.18) 27.94,44.45 27.05,45.34 27.05,61.47 28.19,62.61 34.67,62.61 36.07,61.21 36.07,56.64 37.04,55.67 45.89,55.67 46.13,55.91 U3.7
  Top Layer w0.508: R22.2 3.68,58.55 3.05,59.18 3.05,69.47 4.19,70.61 12.06,70.61 13.33,69.34 13.33,46.36 v2(14.35,45.34) ; R17.2 21.07,45.35 v2(21.08,45.34) 21.72,44.7 21.72,42.93 22.22,42.42 v2(22.99,42.42)
  Bottom Layer w0.508: v2(27.94,43.18) 27.18,42.42 v2(22.99,42.42) ; v2(21.08,45.34) v2(14.35,45.34)
$1N1334: length 7.7
  Top Layer w0.254: LED1.2 42.07,34.38 43.56,32.89 47.12,32.89 47.93,32.08 U1.1
$1N4521: length 8.1
  Top Layer w0.254: LED2.2 42.16,49.11 42.16,47.75 42.8,47.12 47.24,47.12 47.96,46.4 U2.1
$1N6398: length 8.7
  Top Layer w0.254: U4.1 48.05,72.85 46.99,73.91 43.69,73.91 42.16,75.44 LED4.2
$1N6412: length 8.1
  Top Layer w0.254: U3.1 47.93,60.4 47.37,60.96 42.93,60.96 42.07,61.81 LED3.2
$1N17278: length 6.2
  Top Layer w0.254: 15.39,24.84 16.3,24.84 16.89,24.26 17.77,24.26 R5.2 19.5,24.25 C37.2 21.28,24.2 R6.1
$1N17904: length 8.1
  Top Layer w0.254: R5.1 17.78,20.99 R8.2 19.5,20.93 19.54,20.89 ; R5.1 19.5,22.74 C37.1 ; R5.1 17.77,22.73 17.14,22.73 16.3,23.57 15.39,23.57
$1N19975: length 7.4
  Top Layer w0.381: U9.1 7.41,26.11 R10.2 7.18,26.23 C38.2
  Top Layer w0.508: 7.25,26.29 R9.1
$1N22239: length 9.1
  Top Layer w0.381: R11.2 R12.2 5.53,23.57 U9.3
$1N23370: length 6.7
  Top Layer w0.381: R13.2 5.15,24.77 C38.1 7.18,24.83 R10.1 9.78,24.77 U9.2
$1N27431: length 6
  Top Layer w0.508: R14.2 21.33,50.29 U10.7
$1N27675: length 8.2
  Top Layer w0.508: 17.78,48.77 16.89,48.77 16.64,49.02 U10.6 ; 17.78,48.77 R15.2 ; 17.78,48.77 19.5,48.77 C40.2 R17.1 ; 17.78,48.77 R16.1
$1N29433: length 7.4
  Top Layer w0.508: 7.24,51.94 8.01,51.94 8.38,51.56 U10.1 ; 7.24,51.94 R18.1 ; 7.24,51.94 7.24,54.86 R19.2
$1N29693: length 6.2
  Top Layer w0.508: U10.2 8.64,50.29 8.5,50.43 R18.2 R22.1
$1N31851: length 8.1
  Top Layer w0.381: U10.3 5.51,49.02 5.23,48.74 5.23,45.31
$1N44864: length 1.8
  Top Layer w0.254: C47.2 79.38,63.48 R23.1
$1N45543: length 5.1
  Top Layer w0.254: U11.4 80.64,66.8 80.01,66.17 78.84,66.17 R23.2
$1N48445: length 5.4
  Top Layer w0.254: U11.6 81.94,66.7 81.41,66.17 81.41,65.03 C49.2 83.19,64.98 C48.2
$1N53852: length 6.7
  Top Layer w0.254: R26.1 87.07,64.97 C53.2 83.84,66.29 83.06,66.29 82.59,66.76 U11.7
$1N55555: length 4.1
  Top Layer w0.381: 83.24,74.2 83.24,78.18 R24.1
$1N86130: length 2.3
  Top Layer w0.254: LED1.1 R27.2
$1N86342: length 2.3
  Top Layer w0.254: LED2.1 R1.2
$1N86554: length 2.5
  Top Layer w0.254: LED3.1 R2.2
$1N86766: length 2.4
  Top Layer w0.254: LED4.1 R3.2
$1N98330: length 28.8
  Top Layer w0.508: v2(17.4,82.42) 19.05,84.07 U13.1 RF1.5 ; R30.1 9.49,78.61 v2(13.59,78.61)
  Bottom Layer w0.508: v2(13.59,78.61) v2(17.4,82.42)
$2N11015: length 13
  Top Layer w0.254: 91.56,55.37 78.59,55.37
$2N16241: length 14.2
  Top Layer w0.254: U19.1 36.51,10.22 RF7.5
  Top Layer w1.27: RF7.5 29.81,10.16 25.53,10.16 24.38,9.02 H1.1
$2N16244: length 14.2
  Top Layer w0.254: RF8.5 U25.1
  Top Layer w1.27: RF8.5 48.26,10.29 47.12,9.14 H2.1
$2N16819: length 13.1
  Top Layer w0.508: H3.1 72.9,75.85 U26.1 72.9,85.09
$2N23862: length 2.3
  Top Layer w0.254: R33.1 LED5.2
$2N24958: length 2.2
  Top Layer w0.254: LED6.1 R35.1
$2N25511: length 2.2
  Top Layer w0.254: LED7.2 R36.1
$2N27101: length 2.8
  Top Layer w0.254: LED8.2 85.71,31.24
$2N28835: length 2.3
  Top Layer w0.254: R37.2 90.3,31.24

## Copper pours and planes (outline as drawn; the poured copper is in the pictures)
AGND on Top Layer: 27.54,33.98 51.1,33.98 51.1,23.53 27.54,23.53
AGND on Top Layer: 74.18,67.68 77.21,67.68 78.16,66.73 78.16,66.68 78.99,66.68 79.34,67.02 79.34,69.94 79.88,70.49 87.88,70.49 88.52,69.85 88.52,63.12 87.88,62.48 74.17,62.48 74.17,67.68
AGND on Top Layer: 1.78,23.62 16.76,23.62 16.76,18.16 1.78,18.16
AGND on Top Layer: 26.94,48.02 50.51,48.02 50.51,37.58 26.94,37.58
AGND on Top Layer: 2.96,47.98 8.51,47.98 8.51,43.94 2.96,43.94
AGND on Top Layer: 27.06,61.8 50.62,61.8 50.62,51.35 27.06,51.35
AGND on Top Layer: 27.18,74.68 50.74,74.68 50.74,64.23 27.18,64.23
AGND on Bottom Layer: 66.29,62.48 68.83,62.48 68.83,61.98 66.29,61.98
AGND on Bottom Layer: 68.33,85.28 68.33,89.03 69.85,90.55 77.72,90.55 79.12,89.15 79.12,80.77 77.09,78.74 75.31,78.74 75.31,75.95 76.84,74.42 76.84,67.31 77.85,66.29 79.12,66.29 79.63,66.8 79.63,70.99 80.9,72.26 87.25,72.26 87.38,72.39 87.38,80.65 97.28,80.65 97.28,66.29 92.97,61.98 68.45,61.98 68.45,85.15
AGND on Bottom Layer: 68.45,61.34 96.9,61.34 100.46,57.79 100.46,27.18 75.41,27.18 75.41,30.89 73.66,32.64 68.33,32.64 68.33,61.21
AGND on Bottom Layer: 66.68,36.32 68.96,36.32 68.96,35.69 66.68,35.69
AGND on Bottom Layer: 75.82,78.36 78.99,78.36 80.39,76.96 80.39,72.26 79.38,71.25 79.38,67.06 78.99,66.68 78.05,66.68 77.6,67.13 77.6,74.3 75.82,76.07
AGND on Bottom Layer: 75.82,78.36 77.34,78.36 79.76,80.77 79.76,88.65 84.58,88.65 87.12,86.11 87.12,73.03 86.61,72.52 77.65,72.52 77.63,72.49 77.6,72.52 77.6,74.3 75.82,76.07
AGND on Bottom Layer: -3.68,83.19 20.57,83.19 20.57,95.89 20.45,96.01 35.94,96.01 35.94,81.53 38.23,79.25 51.29,79.25 51.31,79.27 51.31,18.92 52.32,17.91 56.77,17.91 57.91,16.76 57.91,5.84 56.77,4.7 21.34,4.7 19.05,6.99 19.05,14.61 18.16,15.49 -3.68,15.49
AGND on Bottom Layer: -3.68,84.07 19.8,84.07 19.8,96.89 19.81,96.9 36.96,96.9 36.96,82.04 38.86,80.14 52.57,80.14 52.58,80.15 52.58,19.43 53.21,18.8 57.53,18.8 58.55,17.78 58.55,5.21 57.4,4.06 20.57,4.06 18.42,6.22 18.42,13.08 16.38,15.11 -3.68,15.11 -3.68,-1.14 103.25,-1.14 103.25,20.19 80.26,20.19 74.93,25.53 74.93,30.61 73.41,32.13 67.31,32.13 67.31,89.83 69.04,91.57 78.61,91.57 80.14,90.04 80.14,82.17 80.65,81.66 97.28,81.66 97.28,93.85 94.62,96.52 58.42,96.52 55.75,99.19 49.78,99.19 46.74,102.24 -3.68,102.24
AGND on Bottom Layer: 43.43,82.8 44.83,82.8 44.83,77.6 43.43,77.6

## Text on the board
Bottom Silkscreen Layer: ±12V/+5V/+3.3V(Digital) | PWR IN: | DA OUT: | ±10V(16bit)/±10V(12bit) | Z+X/Z-X/Z+Y/Z-Y (16bit) | OPAMP: | ±12.288V(16bit) | AD IN: | AD5761/ADS8685/AD5722 | CONTROL_BOARD
Top Silkscreen Layer: SDI1 | CS1 | CLK1 | CS2 | SDO1 | LDAC | 3V3 | SY1| SY2 | SY3 | SY4 | CLK | SDI | GND | Z-X | Z-Y | Z+X | Z+Y | 16Bit-DAC | +12V IN | -12V IN | +5V IN | 12Bit-DAC | ADC_IN
